# Altium schematic sheet DSO_CPLD.SchDoc
size A4
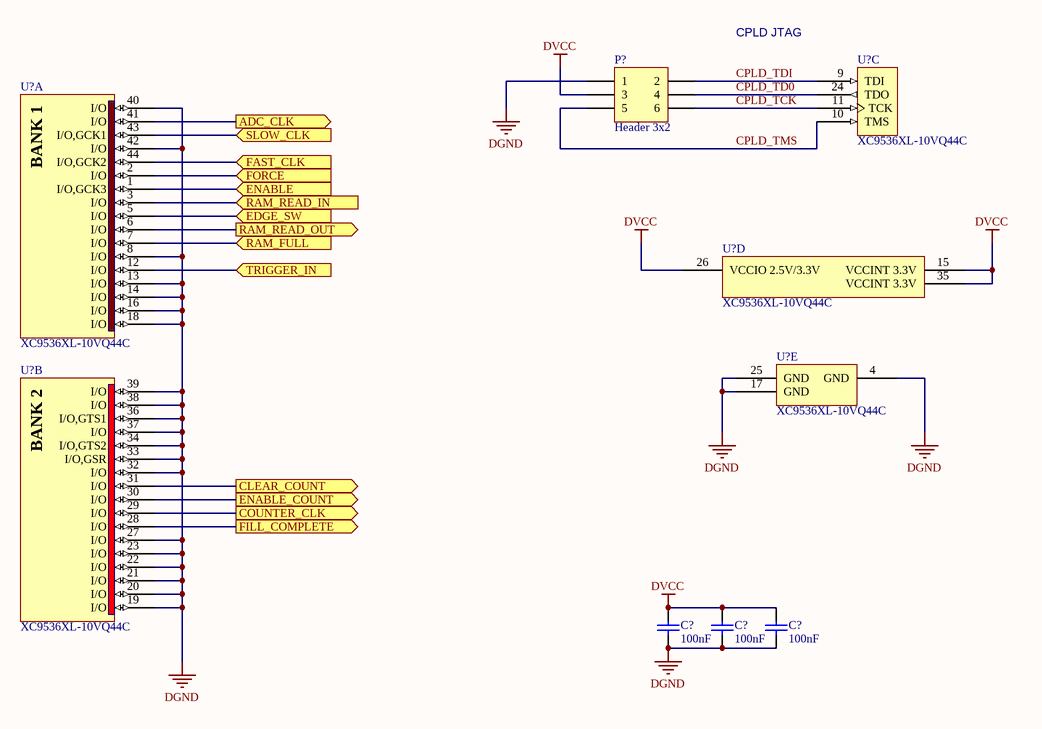
[diagram p0: DSO_CPLD.SchDoc]

## Parts
(Parts that share a designator on the sheet are numbered #1, #2 ... from top to bottom, then left to right.)
C?#1  100nF  [0805C]
C?#2  100nF  [0805C]
C?#3  100nF  [0805C]
P?  Header 3x2  [HDR3x2]
U?#1  XC9536XL-10VQ44C  [VQ44_L]  (part C of 5)
U?#2  XC9536XL-10VQ44C  [VQ44_L]  (part A of 5)
U?#3  XC9536XL-10VQ44C  [VQ44_L]  (part D of 5)
U?#4  XC9536XL-10VQ44C  [VQ44_L]  (part E of 5)
U?#5  XC9536XL-10VQ44C  [VQ44_L]  (part B of 5)

## Ports
ADC_CLK (out), CLEAR_COUNT (out), COUNTER_CLK (out), EDGE_SW (in), ENABLE (in), ENABLE_COUNT (out), FAST_CLK (in), FILL_COMPLETE (out), FORCE (in), RAM_FULL (in), RAM_READ_IN (in), RAM_READ_OUT (out), SLOW_CLK (in), TRIGGER_IN (in)

## Nets
DGND: C?#1.2 C?#2.2 C?#3.2 P?.1 U?#2.8(I/O) U?#2.13(I/O) U?#2.14(I/O) U?#2.16(I/O) U?#2.18(I/O) U?#2.40(I/O) U?#2.42(I/O) U?#4.4(GND) U?#4.17(GND) U?#4.25(GND) U?#5.19(I/O) U?#5.20(I/O) U?#5.21(I/O) U?#5.22(I/O) U?#5.23(I/O) U?#5.27(I/O) U?#5.32(I/O) U?#5.33(I/O,GSR) U?#5.34(I/O,GTS2) U?#5.36(I/O,GTS1) U?#5.37(I/O) U?#5.38(I/O) U?#5.39(I/O)
DVCC: C?#1.1 C?#2.1 C?#3.1 P?.3 U?#3.15(VCCINT_3.3V) U?#3.26(VCCIO_2.5V/3.3V) U?#3.35(VCCINT_3.3V)
ADC_CLK: U?#2.41(I/O) ; port ADC_CLK
CLEAR_COUNT: U?#5.31(I/O) ; port CLEAR_COUNT
COUNTER_CLK: U?#5.29(I/O) ; port COUNTER_CLK
CPLD_TCK: P?.6 U?#1.11(TCK)
CPLD_TD0: P?.4 U?#1.24(TDO)
CPLD_TDI: P?.2 U?#1.9(TDI)
CPLD_TMS: P?.5 U?#1.10(TMS)
EDGE_SW: U?#2.5(I/O) ; port EDGE_SW
ENABLE: U?#2.1(I/O,GCK3) ; port ENABLE
ENABLE_COUNT: U?#5.30(I/O) ; port ENABLE_COUNT
FAST_CLK: U?#2.44(I/O,GCK2) ; port FAST_CLK
FILL_COMPLETE: U?#5.28(I/O) ; port FILL_COMPLETE
FORCE: U?#2.2(I/O) ; port FORCE
RAM_FULL: U?#2.7(I/O) ; port RAM_FULL
RAM_READ_IN: U?#2.3(I/O) ; port RAM_READ_IN
RAM_READ_OUT: U?#2.6(I/O) ; port RAM_READ_OUT
SLOW_CLK: U?#2.43(I/O,GCK1) ; port SLOW_CLK
TRIGGER_IN: U?#2.12(I/O) ; port TRIGGER_IN

## Notes on the sheet
- CPLD JTAG
- (in symbol XC9536XL-10VQG44C, part A) BANK 1
- (in symbol XC9536XL-10VQG44C, part B) BANK 2

## Library data of the parts
C?#1-C?#3 = C: Capacitor; Reviewed by: RM - 2018/08/05; Revision: July-2002: Re-released for DXP Platform.; Value: 100nF; Supplier 1: *; Supplier Part Number 1: *
P? = Header 3x2: Header, 5-Pin; Reviewed by: RM - 2018/08/05; Supplier 1: Digi-Key; Supplier Part Number 1: 952-2121-ND
U?#1-U?#5 = XC9536XL-10VQG44C: FastFLASH XC900XL, 3.3V High-Performance 36 Macrocell CPLD, 34 User I/Os, 44-Pin VQFP, Speed Grade 10, Commercial Grade; Reviewed by: RM - 2018/08/05; Supplier 1: Digi-Key; Supplier Part Number 1: 122-1385-ND